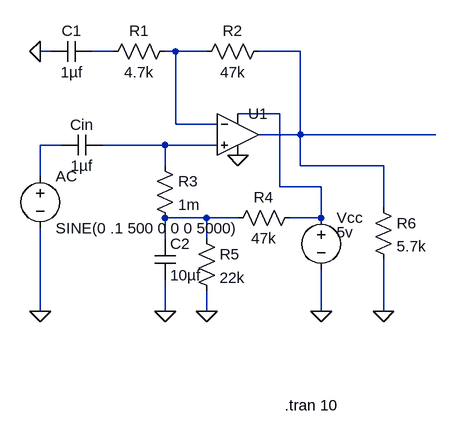
[diagram p0: schematic Prototype_1_0_0.asc]
Prototype_1_0_0.asc, the LTspice schematic file:
Version 4
SHEET 1 1168 880
WIRE 64 208 48 208
WIRE 160 208 128 208
WIRE 256 208 240 208
WIRE 304 208 256 208
WIRE 448 208 384 208
WIRE 416 304 352 304
WIRE 256 320 256 208
WIRE 320 320 256 320
WIRE 448 336 448 208
WIRE 448 336 384 336
WIRE 656 336 448 336
WIRE 80 352 48 352
WIRE 240 352 144 352
WIRE 320 352 240 352
WIRE 240 384 240 352
WIRE 448 384 448 336
WIRE 576 384 448 384
WIRE 48 400 48 352
WIRE 416 416 416 304
WIRE 480 416 416 416
WIRE 576 448 576 384
WIRE 304 464 240 464
WIRE 352 464 304 464
WIRE 480 464 480 416
WIRE 480 464 432 464
WIRE 240 496 240 464
WIRE 304 496 304 464
WIRE 48 608 48 480
WIRE 240 608 240 560
WIRE 304 608 304 576
WIRE 480 608 480 544
WIRE 576 608 576 528
FLAG 48 608 0
FLAG 240 608 0
FLAG 304 608 0
FLAG 480 608 0
FLAG 48 208 0
FLAG 352 368 0
FLAG 576 608 0
SYMBOL UniversalOpAmp 352 336 R0
SYMATTR InstName U1
SYMBOL Voltage 48 384 R0
SYMATTR InstName AC
SYMATTR Value SINE(0 .1 500 0 0 0 5000)
SYMBOL Cap 144 336 R90
WINDOW 0 0 32 VBottom 2
WINDOW 3 32 32 VTop 2
SYMATTR InstName Cin
SYMATTR Value 1µf
SYMBOL Res 224 368 R0
SYMATTR InstName R3
SYMATTR Value 1m
SYMBOL Cap 224 496 R0
SYMATTR InstName C2
SYMATTR Value 10µf
SYMBOL Res 288 480 R0
SYMATTR InstName R5
SYMATTR Value 22k
SYMBOL Res 448 448 R90
WINDOW 0 0 56 VBottom 2
WINDOW 3 32 56 VTop 2
SYMATTR InstName R4
SYMATTR Value 47k
SYMBOL Voltage 480 448 R0
WINDOW 3 24 38 Left 2
SYMATTR Value 5v
SYMATTR InstName Vcc
SYMBOL Res 256 192 R90
WINDOW 0 0 56 VBottom 2
WINDOW 3 32 56 VTop 2
SYMATTR InstName R1
SYMATTR Value 4.7k
SYMBOL Cap 128 192 R90
WINDOW 0 0 32 VBottom 2
WINDOW 3 32 32 VTop 2
SYMATTR InstName C1
SYMATTR Value 1µf
SYMBOL Res 400 192 R90
WINDOW 0 0 56 VBottom 2
WINDOW 3 32 56 VTop 2
SYMATTR InstName R2
SYMATTR Value 47k
SYMBOL Res 560 432 R0
SYMATTR InstName R6
SYMATTR Value 5.7k
TEXT 424 752 Left 2 !.tran 10

The netlist it stands for:
* Prototype_1_0_0.asc
XU1 N006 N002 N004 0 N003 level1 Avol=1Meg GBW=10Meg Vos=0 En=0 Enk=0 In=0 Ink=0 Rin=500Meg  ; pins In+ In- V+ V- OUT
V§AC N005 0 SINE(0 .1 500 0 0 0 5000)
Cin N006 N005 1µf
R3 N006 N007 1m
C2 N007 0 10µf
R5 N007 0 22k
R4 N004 N007 47k
Vcc N004 0 5v
R1 N002 N001 4.7k
C1 N001 0 1µf
R2 N003 N002 47k
R6 N003 0 5.7k
.tran 10
.lib UniversalOpAmp1.lib
.backanno
.end